# EAGLE schematic shield_motor (EAGLE 7.3.0)
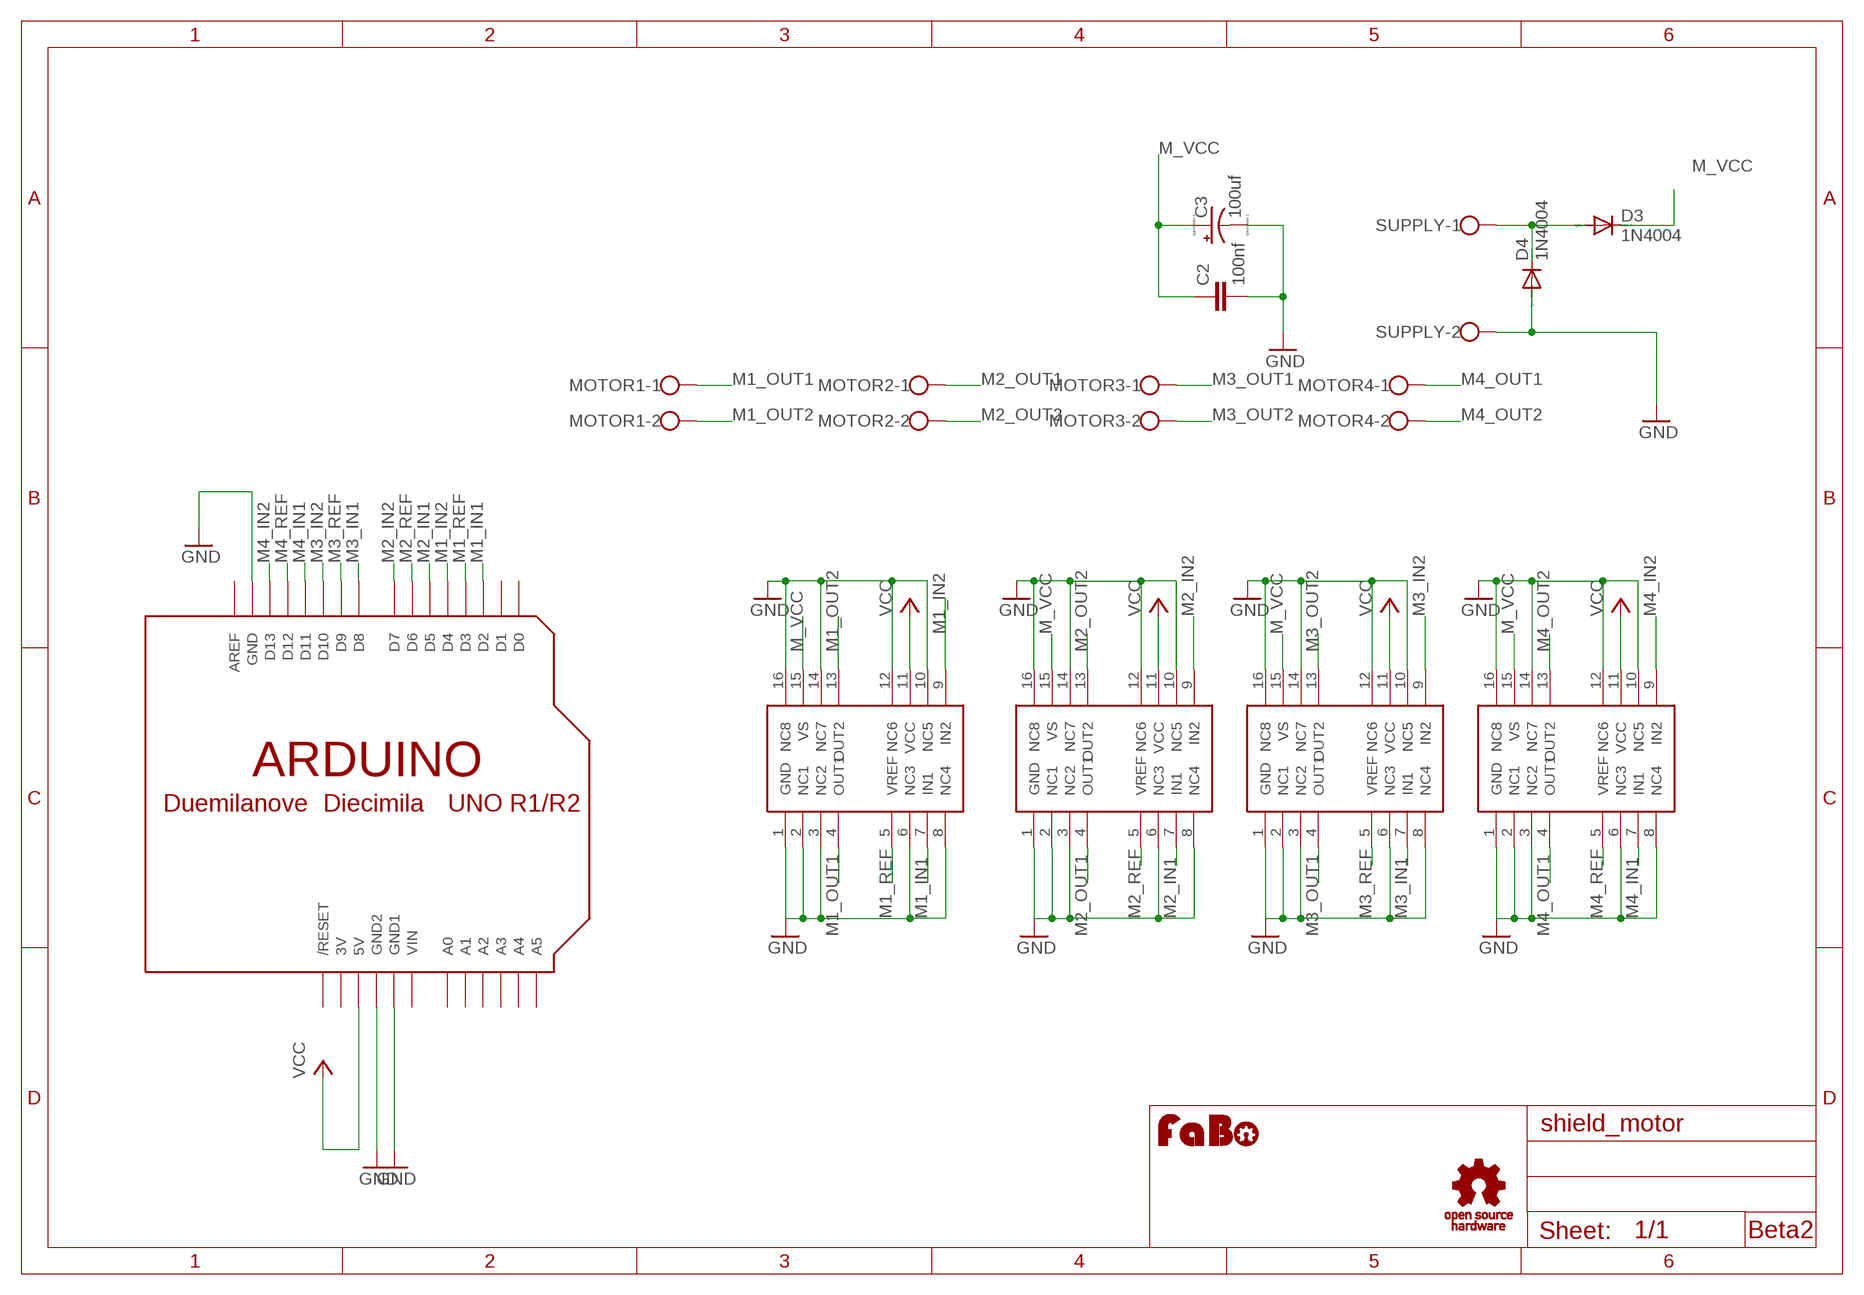
[diagram p0: schematic, sheet 1]

## Parts
C2  100nf  C-EUC0603  [C0603]
C3  100uf  CPOL-US153CLV-0405  [153CLV-0405]
D3  1N4004  [DO41-10]
D4  1N4004  [DO41-10]
MOTOR1  W237-102  [W237-102]
MOTOR2  W237-102  [W237-102]
MOTOR3  W237-102  [W237-102]
MOTOR4  W237-102  [W237-102]
SUPPLY  W237-102  [W237-102]
U$1  ARDUINO-NOHOLE  [ARDUINO-NOHOLE]
U$2  MOTOR-DRIVER-TA7281FG  [MOTOR-DRIVER-TA7291FG]
U$3  MOTOR-DRIVER-TA7281FG  [MOTOR-DRIVER-TA7291FG]
U$4  MOTOR-DRIVER-TA7281FG  [MOTOR-DRIVER-TA7291FG]
U$5  MOTOR-DRIVER-TA7281FG  [MOTOR-DRIVER-TA7291FG]
U$7  LOGO_FABO-M  [LOGO_FABO_M]
U$8  LOGO_OSHW_T-M  [LOGO_OSHW_T_M]

## Nets
GND: C2.2 C3.- D4.A SUPPLY.2 U$1.GND U$1.GND1 U$1.GND2 U$2.1(GND) U$2.2(NC1) U$2.3(NC2) U$2.6(NC3) U$2.8(NC4) U$2.10(NC5) U$2.12(NC6) U$2.14(NC7) U$2.16(NC8) U$3.1(GND) U$3.2(NC1) U$3.3(NC2) U$3.6(NC3) U$3.8(NC4) U$3.10(NC5) U$3.12(NC6) U$3.14(NC7) U$3.16(NC8) U$4.1(GND) U$4.2(NC1) U$4.3(NC2) U$4.6(NC3) U$4.8(NC4) U$4.10(NC5) U$4.12(NC6) U$4.14(NC7) U$4.16(NC8) U$5.1(GND) U$5.2(NC1) U$5.3(NC2) U$5.6(NC3) U$5.8(NC4) U$5.10(NC5) U$5.12(NC6) U$5.14(NC7) U$5.16(NC8)
M1_IN1: U$1.D2 U$3.7(IN1)
M1_IN2: U$1.D4 U$3.9(IN2)
M1_OUT1: MOTOR1.1 U$3.4(OUT1)
M1_OUT2: MOTOR1.2 U$3.13(OUT2)
M1_REF: U$1.D3 U$3.5(VREF)
M2_IN1: U$1.D5 U$4.7(IN1)
M2_IN2: U$1.D7 U$4.9(IN2)
M2_OUT1: MOTOR2.1 U$4.4(OUT1)
M2_OUT2: MOTOR2.2 U$4.13(OUT2)
M2_REF: U$1.D6 U$4.5(VREF)
M3_IN1: U$1.D8 U$2.7(IN1)
M3_IN2: U$1.D10 U$2.9(IN2)
M3_OUT1: MOTOR3.1 U$2.4(OUT1)
M3_OUT2: MOTOR3.2 U$2.13(OUT2)
M3_REF: U$1.D9 U$2.5(VREF)
M4_IN1: U$1.D11 U$5.7(IN1)
M4_IN2: U$1.D13 U$5.9(IN2)
M4_OUT1: MOTOR4.1 U$5.4(OUT1)
M4_OUT2: MOTOR4.2 U$5.13(OUT2)
M4_REF: U$1.D12 U$5.5(VREF)
M_VCC: C2.1 C3.+ D3.C U$2.15(VS) U$3.15(VS) U$4.15(VS) U$5.15(VS)
N$1: D3.A D4.C SUPPLY.1
VCC: U$1.5V U$2.11(VCC) U$3.11(VCC) U$4.11(VCC) U$5.11(VCC)
Unconnected: U$1.A0 U$1.A1 U$1.A2 U$1.A3 U$1.A4 U$1.A5 U$1.AREF U$1.D0 U$1.D1 U$1.RESET(/RESET)

## Notes on the sheet
- Beta2

## Power pins joined to a net without a drawn wire
3V: U$1.3V
VIN: U$1.VIN

## Library data of the parts
C2 = rcl:C-EU: CAPACITOR, European symbol
C3 = resistor:CPOL-US: POLARIZED CAPACITOR, American symbol
D3 D4 = diode:1N4004: DIODE general purpose rectifier, 1 A
MOTOR1-MOTOR4 SUPPLY = con-wago-500:W237-102: WAGO SCREW CLAMP; MPN: 237-102; OC_FARNELL: unknown; OC_NEWARK: 70K9898
U$1 = adafruit:ARDUINO: Arduino Diecimila/Duemilanove Make a shield with ease, this package has all the named pins as well as the two mounting drill holes and an outline of the USB and DC power connector. The outline is on the DIMENSION layer, so if your board house uses it they will cut the outline to match. http://www.ladyada.net/library/pcb/eaglelibrary.html
U$2-U$5 = gclue:MOTOR-DRIVER-TA7281FG
U$7 = FaBo:LOGO_FABO
U$8 = gclue:LOGO_OSHW_T